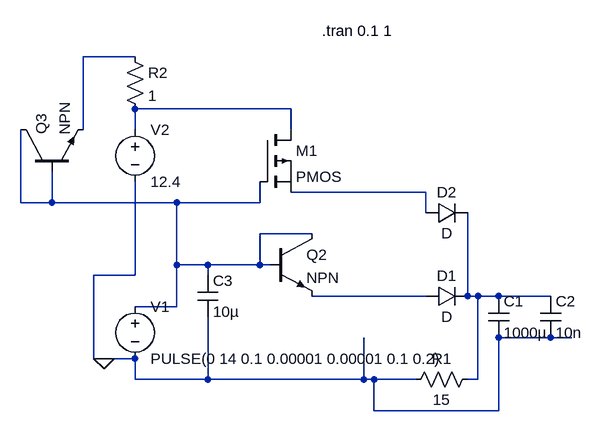
[diagram p0: schematic Draft24.asc]
Draft24.asc, the LTspice schematic file:
Version 4
SHEET 1 888 680
WIRE 192 64 112 64
WIRE 432 144 192 144
WIRE 112 176 112 64
WIRE 192 176 192 144
WIRE 432 176 432 144
WIRE 640 272 432 272
WIRE 16 288 16 176
WIRE 64 288 64 240
WIRE 64 288 16 288
WIRE 256 288 64 288
WIRE 384 288 384 256
WIRE 384 288 256 288
WIRE 640 304 640 272
WIRE 464 336 384 336
WIRE 256 384 256 288
WIRE 304 384 256 384
WIRE 384 384 384 336
WIRE 384 384 304 384
WIRE 400 384 384 384
WIRE 192 400 192 256
WIRE 192 400 128 400
WIRE 304 400 304 384
WIRE 640 432 464 432
WIRE 704 432 704 304
WIRE 720 432 704 432
WIRE 752 432 720 432
WIRE 832 432 752 432
WIRE 256 448 256 384
WIRE 256 448 192 448
WIRE 832 496 752 496
WIRE 864 496 832 496
WIRE 128 528 128 400
WIRE 144 528 128 528
WIRE 192 528 144 528
WIRE 192 560 192 528
WIRE 304 560 304 464
WIRE 304 560 192 560
WIRE 544 560 544 496
WIRE 544 560 304 560
WIRE 560 560 544 560
WIRE 624 560 560 560
WIRE 720 560 720 432
WIRE 720 560 704 560
WIRE 560 608 560 560
WIRE 752 608 752 496
WIRE 752 608 560 608
FLAG 144 528 0
SYMBOL voltage 192 432 R0
SYMATTR InstName V1
SYMATTR Value PULSE(0 14 0.1 0.00001 0.00001 0.1 0.2)
SYMBOL voltage 192 160 R0
SYMATTR InstName V2
SYMATTR Value 12.4
SYMBOL diode 640 448 R270
WINDOW 0 32 32 VTop 2
WINDOW 3 0 32 VBottom 2
SYMATTR InstName D1
SYMBOL res 720 544 R90
WINDOW 0 0 56 VBottom 2
WINDOW 3 32 56 VTop 2
SYMATTR InstName R1
SYMATTR Value 15
SYMBOL cap 736 432 R0
SYMATTR InstName C1
SYMATTR Value 1000µ
SYMBOL npn 400 336 R0
SYMATTR InstName Q2
SYMBOL diode 640 320 R270
WINDOW 0 32 32 VTop 2
WINDOW 3 0 32 VBottom 2
SYMATTR InstName D2
SYMBOL cap 816 432 R0
SYMATTR InstName C2
SYMATTR Value 10n
SYMBOL cap 288 400 R0
SYMATTR InstName C3
SYMATTR Value 10µ
SYMBOL npn 16 240 R270
SYMATTR InstName Q3
SYMBOL res 176 48 R0
SYMATTR InstName R2
SYMATTR Value 1
SYMBOL pmos 384 176 R0
SYMATTR InstName M1
TEXT 480 24 Left 2 !.tran 0.1 1

The netlist it stands for:
* Draft24.asc
V1 N004 0 PULSE(0 14 0.1 0.00001 0.00001 0.1 0.2)
V2 N002 0 12.4
D1 N005 N006 D
R1 N006 0 15
C1 N006 0 1000µ
Q2 N004 N004 N005 0 NPN
D2 N003 N006 D
C2 N006 0 10n
C3 N004 0 10µ
Q3 N004 N004 N001 0 NPN
R2 N001 N002 1
M1 N002 N004 N003 N003 PMOS
.model D D
.lib standard.dio
.model NPN NPN
.model PNP PNP
.lib standard.bjt
.model NMOS NMOS
.model PMOS PMOS
.lib standard.mos
.tran 0.1 1
.backanno
.end